# EAGLE schematic KickerBoard (EAGLE 9.3.0)
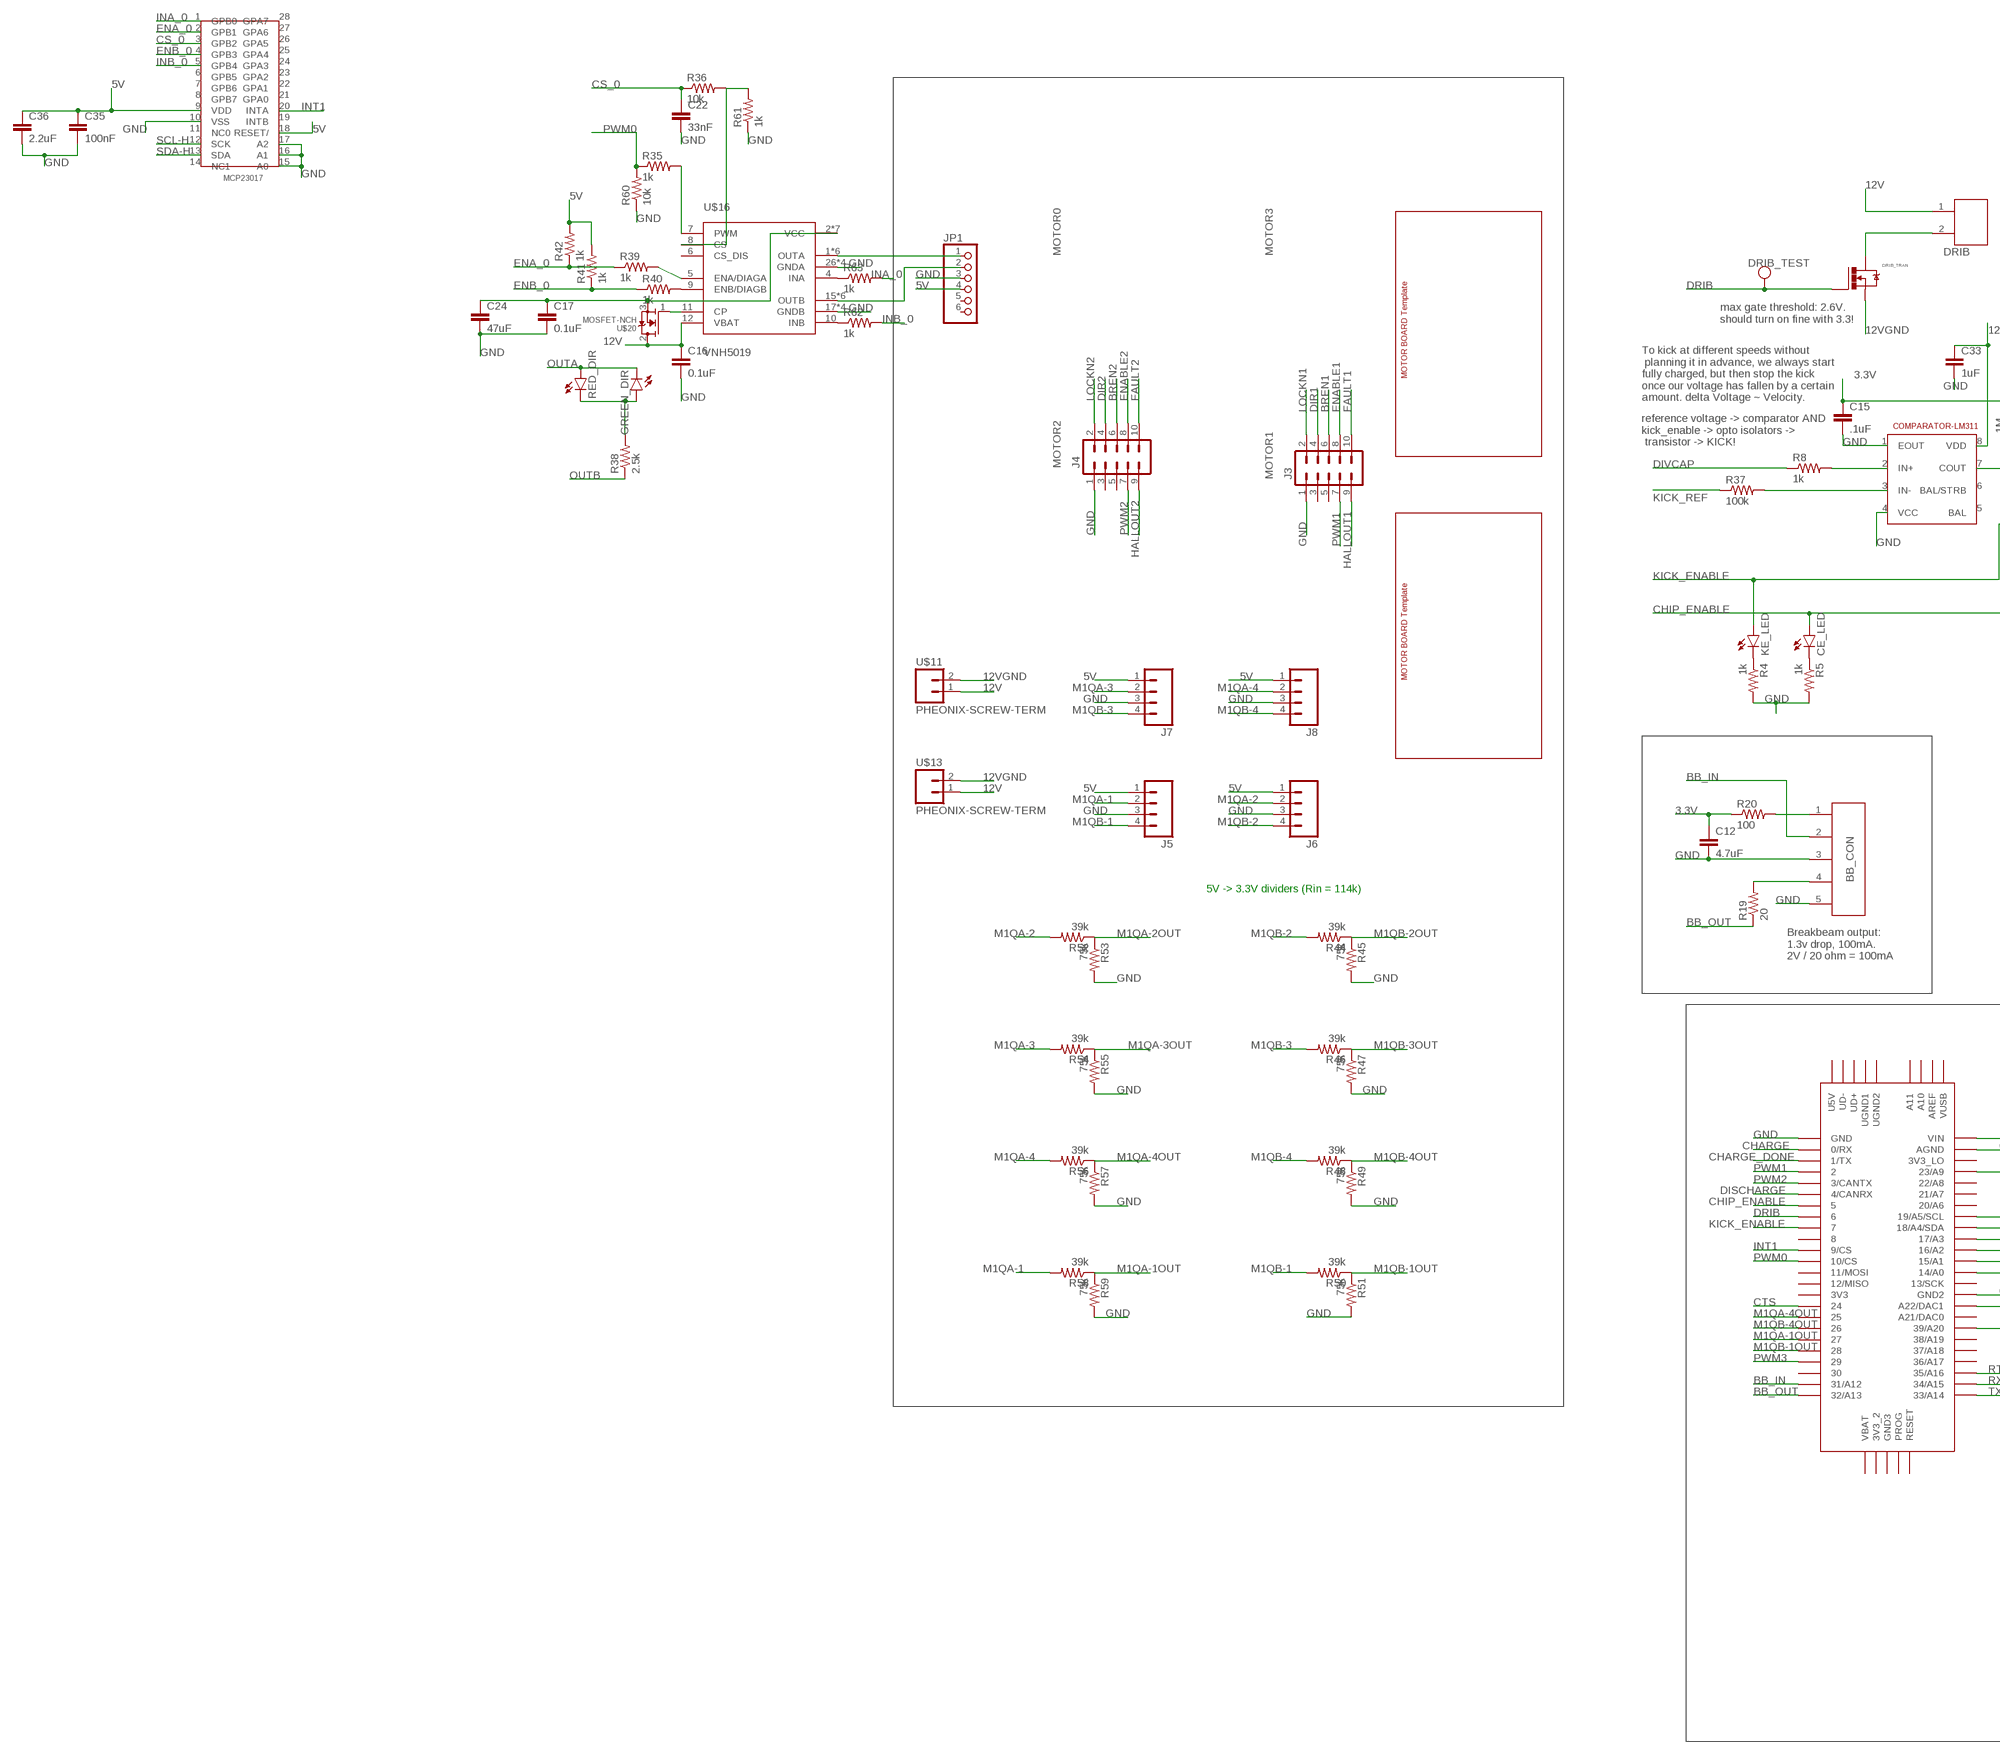
[diagram p0: schematic, sheet 1, part 1 of 2]
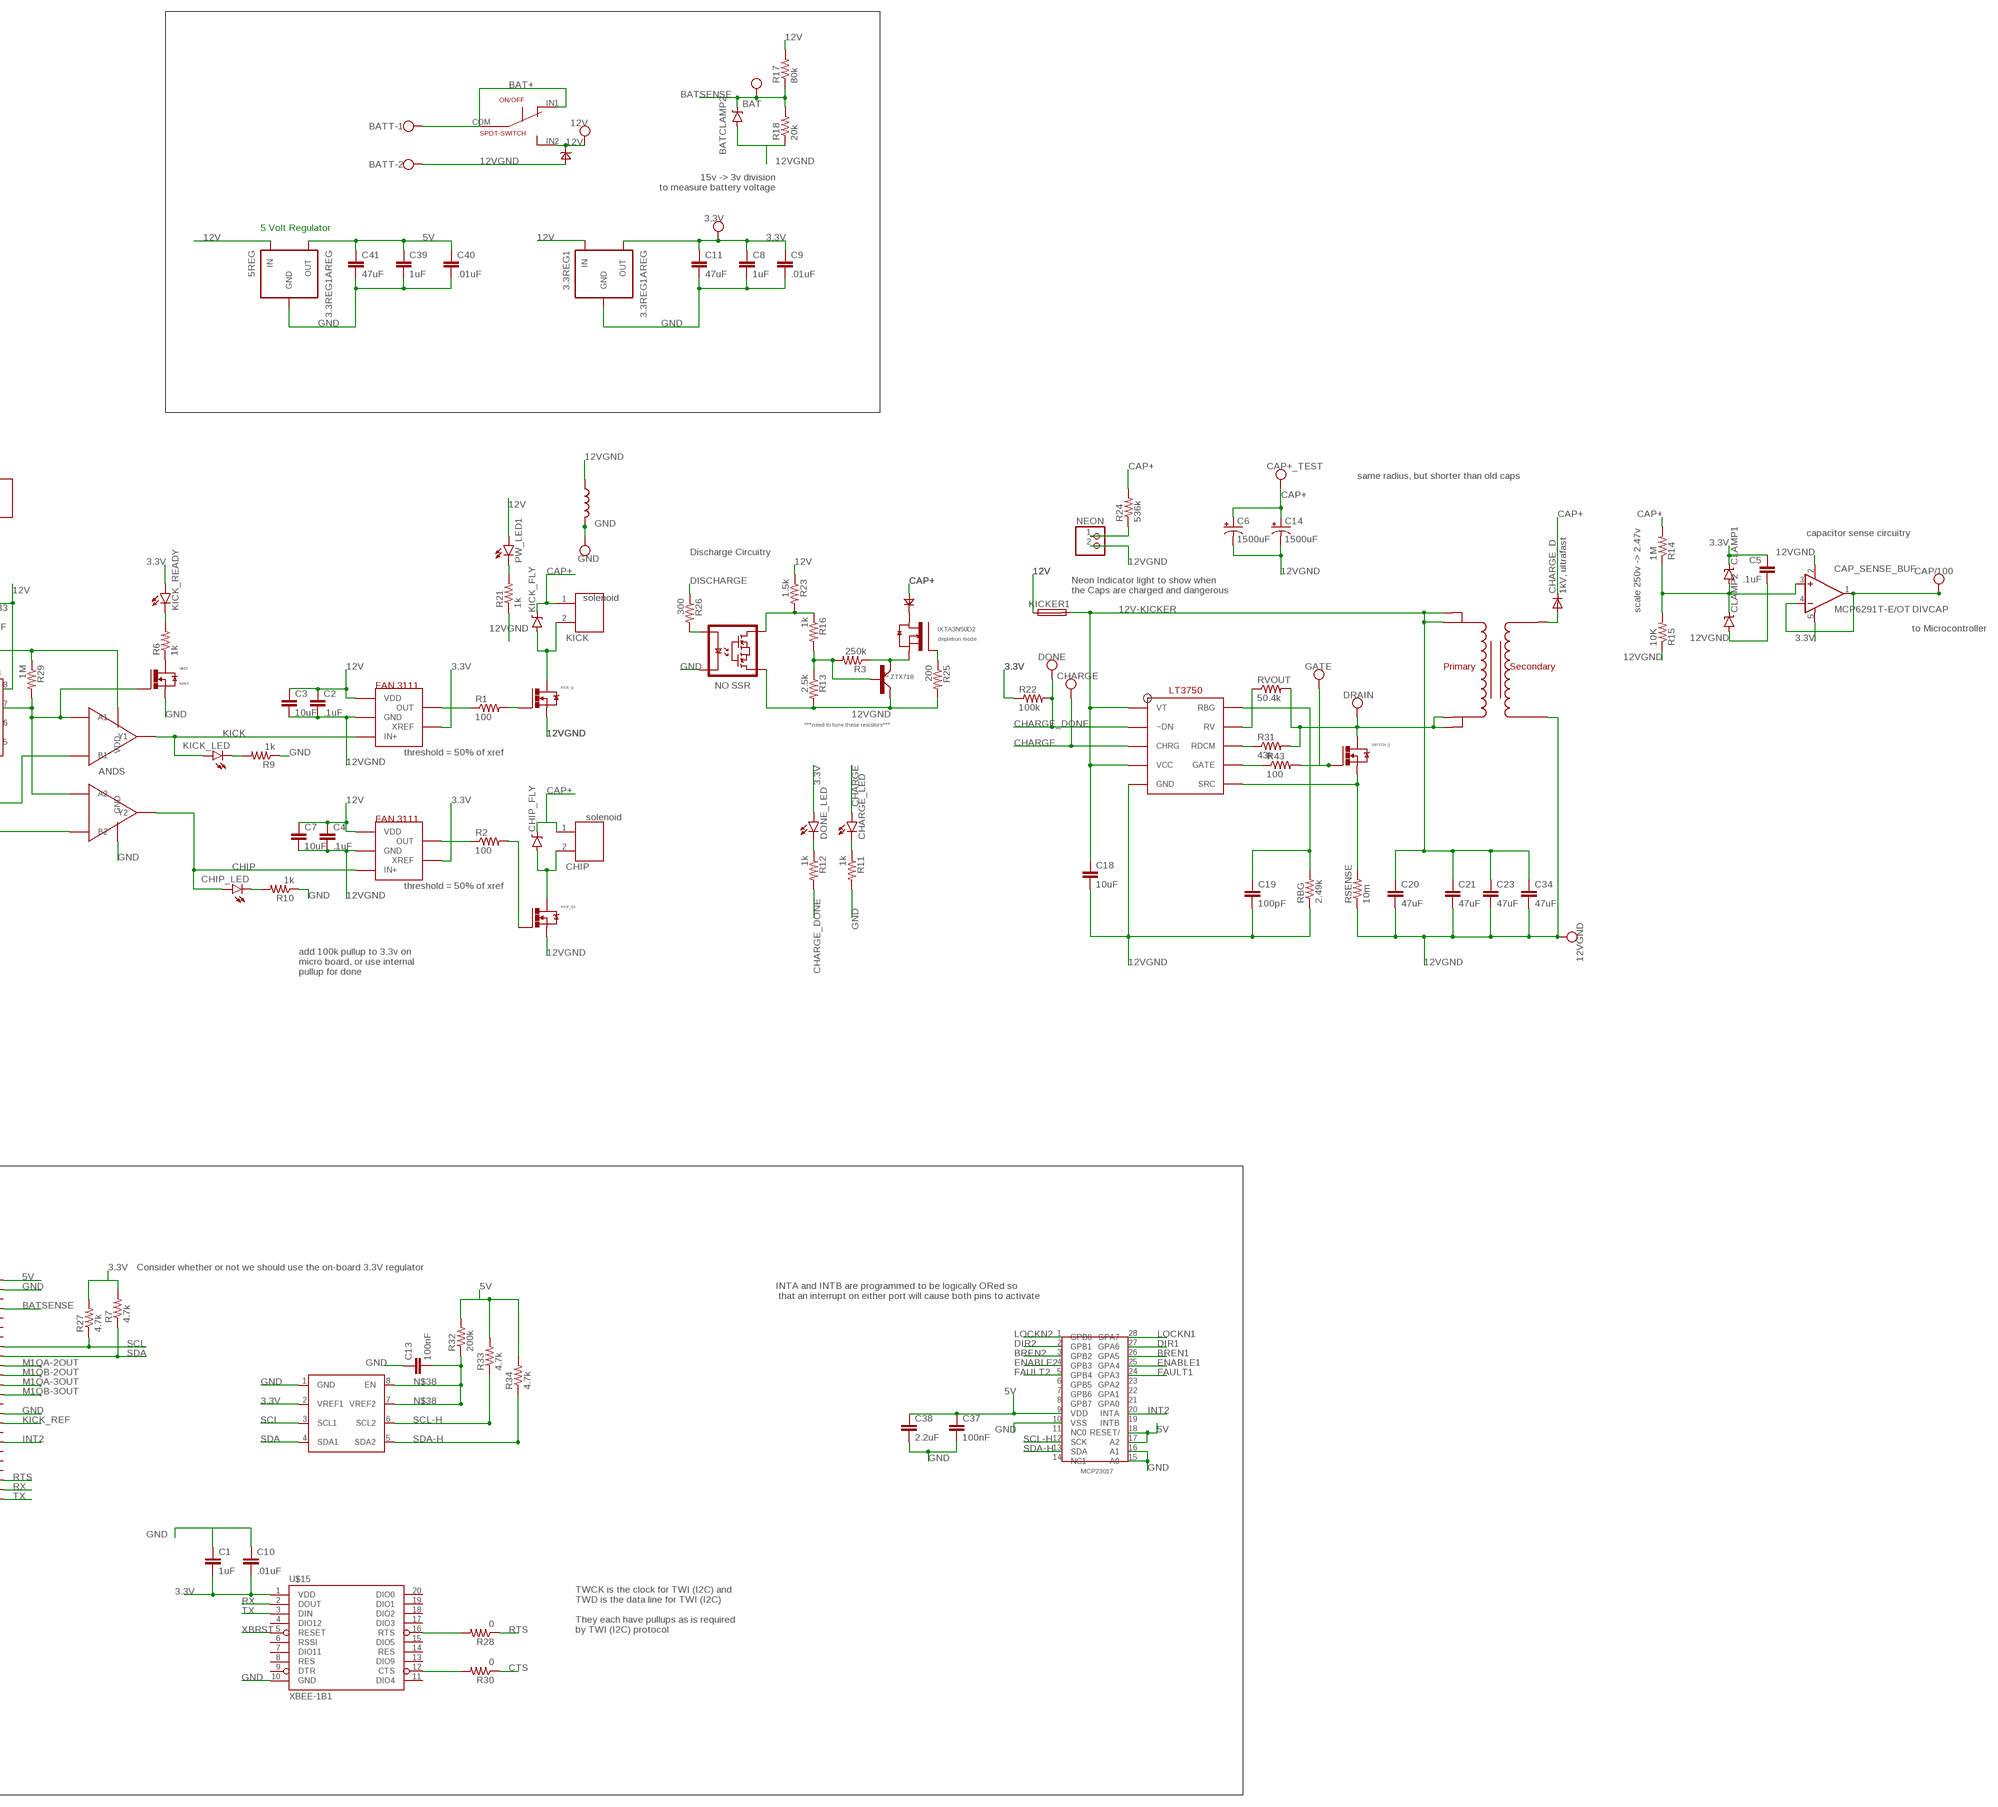
[diagram p1: schematic, sheet 1, part 2 of 2]

## Parts
3.3REG1  3.3REG1AREG  [DPAK]
3.3V  TEST_PT  [TESTING_PT]
5REG  3.3REG1AREG  [DPAK]
12V  TEST_PT  [TESTING_PT]
12VGND  TEST_PT  [TESTING_PT]
ANDS  AND-DUAL  [TSSOP8]
BAT  TEST_PT  [TESTING_PT]
BATCLAMP2  DIODE-ZENERDO214AC  [DO214AC]
BATT  W237-102  [W237-102]
BB_CON  JST-5  [JST-5-2MM]
C1  1uF  CAP1206  [1206]
C2  .1uF  CAP1206  [1206]
C3  10uF  CAP1206  [1206]
C4  .1uF  CAP1206  [1206]
C5  .1uF  CAP0805  [0805]
C6  1500uF  CPOL-USE10-35  [EB35D]
C7  10uF  CAP1206  [1206]
C8  1uF  CAP0805  [0805]
C9  .01uF  CAP0805  [0805]
C10  .01uF  CAP1206  [1206]
C11  47uF  CAP1206  [1206]
C12  4.7uF  CAP0805  [0805]
C13  100nF  CAP0805  [0805]
C14  1500uF  CPOL-USE10-35  [EB35D]
C15  .1uF  CAP0805  [0805]
C16  0.1uF  CAP0805  [0805]
C17  0.1uF  CAP0805  [0805]
C18  10uF  CAP0805  [0805]
C19  100pF  CAP0805  [0805]
C20  47uF  CAP1206  [1206]
C21  47uF  CAP1206  [1206]
C22  33nF  CAP0805  [0805]
C23  47uF  CAP1206  [1206]
C24  47uF  CAP1206  [1206]
C33  1uF  CAP1206  [1206]
C34  47uF  CAP1206  [1206]
C35  100nF  CAP0805  [0805]
C36  2.2uF  CAP0805  [0805]
C37  100nF  CAP0805  [0805]
C38  2.2uF  CAP0805  [0805]
C39  1uF  CAP0805  [0805]
C40  .01uF  CAP0805  [0805]
C41  47uF  CAP1206  [1206]
CAP+_TEST  TEST_PT  [TESTING_PT]
CAP/100  TEST_PT  [TESTING_PT]
CAP_SENSE_BUF  MCP6291T-E/OT  [SOT23-5]
CE_LED  LED1206  [LED-1206]
CHARGE  TEST_PT  [TESTING_PT]
CHARGE_D  1kV, ultrafast  DIODE-DO214AC  [DO214AC]
CHARGE_LED  LED1206  [LED-1206]
CHARGE_U  LT3750  [10-MSOP]
CHIP  JST-22MM  [JST-2-2MM]
CHIP_FLY  DIODE-ZENERDO214AB  [DO214AB]
CHIP_LED  LED1206  [LED-1206]
CLAMP1  DIODE-ZENERDO214AC  [DO214AC]
CLAMP2  DIODE-ZENERDO214AC  [DO214AC]
DONE  TEST_PT  [TESTING_PT]
DONE_LED  LED1206  [LED-1206]
DRAIN  TEST_PT  [TESTING_PT]
DRIB  JST-22MM  [JST-2-2MM]
DRIB_TEST  TEST_PT  [TESTING_PT]
DRIB_TRAN  N-MOSFETDPAK  [DPAK]
GATE  TEST_PT  [TESTING_PT]
GND  TEST_PT  [TESTING_PT]
GREEN_DIR  LED1206  [LED-1206]
J3  M05X2SHD  [2X5-SHROUDED]
J4  M05X2SHD  [2X5-SHROUDED]
J5  M04PTH  [1X04]
J6  M04PTH  [1X04]
J7  M04PTH  [1X04]
J8  M04PTH  [1X04]
JP1  PINHD-1X6  [1X06]
KE_LED  LED1206  [LED-1206]
KICK  JST-22MM  [JST-2-2MM]
KICK_FLY  DIODE-ZENERDO214AB  [DO214AB]
KICK_LED  LED1206  [LED-1206]
KICK_Q  N-MOSFETDPAK  [DPAK]
KICK_Q1  N-MOSFETDPAK  [DPAK]
KICK_READY  LED1206  [LED-1206]
KICKER1  TR5  [TR5]
NEON  PINHD-1X2  [1X02]
ON/OFF  SPDT-SWITCH  [CK_SWITCH]
PW_LED1  LED1206  [LED-1206]
R1  100  RESISTOR0805-RES  [0805]
R2  100  RESISTOR0805-RES  [0805]
R3  250k  RESISTOR0805-RES  [0805]
R4  1k  RESISTOR0805-RES  [0805]
R5  1k  RESISTOR0805-RES  [0805]
R6  1k  RESISTOR0805-RES  [0805]
R7  4.7k  RESISTOR0805-RES  [0805]
R8  1k  RESISTOR0805-RES  [0805]
R9  1k  RESISTOR0805-RES  [0805]
R10  1k  RESISTOR0805-RES  [0805]
R11  1k  RESISTOR0805-RES  [0805]
R12  1k  RESISTOR0805-RES  [0805]
R13  2.5k  RESISTOR0805-RES  [0805]
R14  1M  RESISTOR0805-RES  [0805]
R15  10K  RESISTOR0805-RES  [0805]
R16  1k  RESISTOR0805-RES  [0805]
R17  80k  RESISTOR0805-RES  [0805]
R18  20k  RESISTOR0805-RES  [0805]
R19  20  RESISTOR0805-RES  [0805]
R20  100  RESISTOR0805-RES  [0805]
R21  1k  RESISTOR0805-RES  [0805]
R22  100k  RESISTOR0805-RES  [0805]
R23  1.5k  RESISTOR0805-RES  [0805]
R24  536k  RESISTOR0805-RES  [0805]
R25  200  RESISTOR0805-RES  [0805]
R26  300  RESISTOR0805-RES  [0805]
R27  4.7k  RESISTOR0805-RES  [0805]
R28  0  RESISTOR0805-RES  [0805]
R29  1M  RESISTOR0805-RES  [0805]
R30  0  RESISTOR0805-RES  [0805]
R31  43k  RESISTOR0805-RES  [0805]
R32  200k  RESISTOR0805-RES  [0805]
R33  4.7k  RESISTOR0805-RES  [0805]
R34  4.7k  RESISTOR0805-RES  [0805]
R35  1k  RESISTOR0805-RES  [0805]
R36  10k  RESISTOR0805-RES  [0805]
R37  100k  RESISTOR0805-RES  [0805]
R38  2.5k  RESISTOR0805-RES  [0805]
R39  1k  RESISTOR0805-RES  [0805]
R40  1k  RESISTOR0805-RES  [0805]
R41  1k  RESISTOR0805-RES  [0805]
R42  1k  RESISTOR0805-RES  [0805]
R43  100  RESISTOR0805-RES  [0805]
R44  39k  RESISTOR0805-RES  [0805]
R45  75k  RESISTOR0805-RES  [0805]
R46  39k  RESISTOR0805-RES  [0805]
R47  75k  RESISTOR0805-RES  [0805]
R48  39k  RESISTOR0805-RES  [0805]
R49  75k  RESISTOR0805-RES  [0805]
R50  39k  RESISTOR0805-RES  [0805]
R51  75k  RESISTOR0805-RES  [0805]
R52  39k  RESISTOR0805-RES  [0805]
R53  75k  RESISTOR0805-RES  [0805]
R54  39k  RESISTOR0805-RES  [0805]
R55  75k  RESISTOR0805-RES  [0805]
R56  39k  RESISTOR0805-RES  [0805]
R57  75k  RESISTOR0805-RES  [0805]
R58  39k  RESISTOR0805-RES  [0805]
R59  75k  RESISTOR0805-RES  [0805]
R60  10k  RESISTOR0805-RES  [0805]
R61  1k  RESISTOR0805-RES  [0805]
R62  1k  RESISTOR0805-RES  [0805]
R63  1k  RESISTOR0805-RES  [0805]
RBG  2.49k  RESISTOR0805-RES  [0805]
RED_DIR  LED1206  [LED-1206]
RSENSE  10m  RESISTOR2512  [R2512]
RVOUT  50.4k  RESISTOR0805-RES  [0805]
SWITCH_Q  N-MOSFETDPAK  [DPAK]
U$1  FAN31111  [SOT23-5]
U$2  IXTA3N50D2  [TO-263]
U$3  32052-TRANSFORMER  [10-TRANSFORMER]
U$4  FAN31111  [SOT23-5]
U$5  VO1400AEFTR  [SOP4]
U$6  ZTX718  [TO92]
U$7  1N4007  [THROUGH-HOLE-2]
U$8  PCA9306  [SOIC8]
U$9  MOTOR_BOARD  [MOTOR_BOARD]
U$10  MOTOR_BOARD  [MOTOR_BOARD]
U$11  PHEONIX-SCREW-TERM  [1X02-PHEONIX]
U$12  13VZENER  [THROUGH-HOLE-2]
U$13  PHEONIX-SCREW-TERM  [1X02-PHEONIX]
U$14  TEENSY_3.5/3.6  [TEENSY_3.5/3.6]
U$15  XBEE-1B1  [XBEE-1]
U$16  VNH5019  [MULTIPOWERSO-30]
U$17  IO-EXPANDER  [SSOP]
U$18  LM311  [SOIC8]
U$19  INDUCTOR  [0805]
U$20  MOSFET-NCH  [TO252-3]
U$21  IO-EXPANDER  [SSOP]
U$22  N-FET  [SOT-23]

## Nets
3.3V: 3.3REG1.SOURCE(OUT) 3.3V.P$1 ANDS.P$8(VDD) C1.2 C5.1 C8.1 C9.1 C10.2 C11.1 C12.1 C15.1 CAP_SENSE_BUF.5(V+) CLAMP1.C DONE_LED.A KICK_READY.A R7.2 R20.1 R22.1 R27.2 R29.1 U$1.4(XREF) U$4.4(XREF) U$8.2(VREF1) U$15.1(VDD)
5V: 5REG.SOURCE(OUT) C35.1 C36.1 C37.1 C38.1 C39.1 C40.1 C41.1 J5.1 J6.1 J7.1 J8.1 JP1.4 R32.2 R33.2 R34.2 R41.2 R42.2 U$14.VIN U$17.9(VDD) U$17.18(RESET/) U$21.9(VDD) U$21.17(A2) U$21.18(RESET/)
12V: 3.3REG1.GATE(IN) 5REG.GATE(IN) 12V.P$1 C2.1 C3.1 C4.1 C7.1 C16.1 C33.1 DRIB.1 KICKER1.1 ON/OFF.IN2(P2) PW_LED1.A R17.2 R23.1 U$1.1(VDD) U$4.1(VDD) U$11.1 U$12.- U$13.1 U$16.12(VBAT) U$18.8(VDD) U$20.2(D)
12V-KICKER: C18.1 C20.1 C21.1 C23.1 C34.1 CHARGE_U.P$1(VT) CHARGE_U.P$4(VCC) KICKER1.2 U$3.P$4 U$3.P$5
12VGND: 12VGND.P$1 BATCLAMP2.A BATT.2 C2.2 C3.2 C4.2 C5.2 C6.- C7.2 C14.- C18.2 C19.2 C20.2 C21.2 C23.2 C34.2 CAP_SENSE_BUF.2(V-) CHARGE_U.P$5(GND) CLAMP2.A DRIB_TRAN.SOURCE(S) KICK_Q1.SOURCE(S) KICK_Q.SOURCE(S) NEON.2 R13.2 R15.1 R18.1 R21.1 R25.2 RBG.1 RSENSE.1 U$1.2(GND) U$3.P$10 U$4.2(GND) U$5.3(S2) U$6.LEFT(COLLECTOR) U$11.2 U$12.+ U$13.2 U$19.1
BAT+: BATT.1 ON/OFF.COM ON/OFF.IN1(P1)
BATSENSE: BAT.P$1 BATCLAMP2.C R17.1 R18.2 U$14.23/A9
BB_IN: BB_CON.2 U$14.31/A12
BB_OUT: R19.1 U$14.32/A13
BREN1: J3.6 U$21.26(GPA5)
BREN2: J4.6 U$21.3(GPB2)
CAP+: C6.+ C14.+ CAP+_TEST.P$1 CHARGE_D.C CHIP.1 CHIP_FLY.CATHODE(C) KICK.1 KICK_FLY.CATHODE(C) R14.2 R24.2 U$7.+(D+)
CHARGE: CHARGE.P$1 CHARGE_LED.A CHARGE_U.P$3(CHRG) U$14.0/RX
CHARGE_DONE: CHARGE_U.P$2(~DN) DONE.P$1 R12.2 R22.2 U$14.1/TX
CHIP: ANDS.P$3(Y2) CHIP_LED.A U$1.3(IN+)
CHIP_ENABLE: ANDS.P$6(B2) CE_LED.A U$14.5
COMP_OUT: ANDS.P$1(A1) ANDS.P$5(A2) R29.2 U$18.7(COUT) U$22.G
CS_0: C22.1 R36.1 U$17.3(GPB2)
CTS: R30.1 U$14.24
DIR1: J3.4 U$21.27(GPA6)
DIR2: J4.4 U$21.2(GPB1)
DISCHARGE: R26.1 U$14.4/CANRX
DIVCAP: CAP/100.P$1 CAP_SENSE_BUF.1(OUT) CAP_SENSE_BUF.4(-IN) R8.1
DRIB: DRIB_TEST.P$1 DRIB_TRAN.GATE(G) U$14.6
ENA_0: R39.1 R42.1 U$17.2(GPB1)
ENABLE1: J3.8 U$21.25(GPA4)
ENABLE2: J4.8 U$21.4(GPB3)
ENB_0: R40.1 R41.1 U$17.4(GPB3)
FAULT1: J3.10 U$21.24(GPA3)
FAULT2: J4.10 U$21.5(GPB4)
GND: 3.3REG1.DRAIN(GND) 5REG.DRAIN(GND) ANDS.P$4(GND) BB_CON.3 BB_CON.5 C8.2 C9.2 C10.1 C11.2 C12.2 C13.1 C15.2 C16.2 C17.2 C22.2 C24.2 C33.2 C35.2 C36.2 C37.2 C38.2 C39.2 C40.2 C41.2 GND.P$1 J3.1 J4.1 J5.3 J6.3 J7.3 J8.3 JP1.3 R4.2 R5.2 R9.1 R10.1 R11.2 R45.2 R47.2 R49.2 R51.2 R53.2 R55.2 R57.2 R59.2 R60.1 R61.1 U$5.2(LED-) U$8.1(GND) U$14.AGND U$14.GND U$14.GND2 U$15.10(GND) U$16.17(GNDB) U$16.18(GNDB) U$16.19(GNDB) U$16.20(GNDB) U$16.26(GNDA) U$16.27(GNDA) U$16.28(GNDA) U$16.29(GNDA) U$17.10(VSS) U$17.15(A0) U$17.16(A1) U$17.17(A2) U$18.1(EOUT) U$18.4(VCC) U$19.2 U$21.10(VSS) U$21.15(A0) U$21.16(A1) U$22.S
HALLOUT1: J3.9
HALLOUT2: J4.9
INA_0: R63.2 U$17.1(GPB0)
INB_0: R62.2 U$17.5(GPB4)
INT1: U$14.9/CS U$17.20(INTA)
INT2: U$14.39/A20 U$21.20(INTA)
KICK: ANDS.P$7(Y1) KICK_LED.A U$4.3(IN+)
KICK_ENABLE: ANDS.P$2(B1) KE_LED.A U$14.7
KICK_REF: R37.1 U$14.A22/DAC1
LOCKN1: J3.2 U$21.28(GPA7)
LOCKN2: J4.2 U$21.1(GPB0)
LOWCHIP: CHIP.2 CHIP_FLY.ANODE(A) KICK_Q1.DRAIN(D)
LOWKICK: KICK.2 KICK_FLY.ANODE(A) KICK_Q.DRAIN(D)
M1QA-1: J5.2 R58.2
M1QA-1OUT: R58.1 R59.1 U$14.27
M1QA-2: J6.2 R52.2
M1QA-2OUT: R52.1 R53.1 U$14.17/A3
M1QA-3: J7.2 R54.2
M1QA-3OUT: R54.1 R55.1 U$14.15/A1
M1QA-4: J8.2 R56.2
M1QA-4OUT: R56.1 R57.1 U$14.25
M1QB-1: J5.4 R50.2
M1QB-1OUT: R50.1 R51.1 U$14.28
M1QB-2: J6.4 R44.2
M1QB-2OUT: R44.1 R45.1 U$14.16/A2
M1QB-3: J7.4 R46.2
M1QB-3OUT: R46.1 R47.1 U$14.14/A0
M1QB-4: J8.4 R48.2
M1QB-4OUT: R48.1 R49.1 U$14.26
N$1: DRAIN.P$1 R31.2 RVOUT.2 SWITCH_Q.DRAIN(D) U$3.P$6 U$3.P$7
N$2: R1.1 U$4.5(OUT)
N$3: KICK_Q1.GATE(G) R2.2
N$4: R28.2 U$15.16(RTS)
N$5: R2.1 U$1.5(OUT)
N$6: CHARGE_U.P$8(RDCM) R31.1
N$7: C19.1 CHARGE_U.P$10(RBG) RBG.2
N$8: KICK_Q.GATE(G) R1.2
N$9: GATE.P$1 R43.2 SWITCH_Q.GATE(G)
N$10: R3.1 U$2.LOWER_RIGHT(SOURCE) U$6.RIGHT(EMITTER)
N$11: KE_LED.C R4.1
N$12: CHARGE_U.P$9(RV) RVOUT.1
N$13: CE_LED.C R5.1
N$14: R6.1 U$22.D
N$15: KICK_LED.C R9.2
N$16: R30.2 U$15.12(CTS)
N$17: CHIP_LED.C R10.2
N$18: R3.2 R13.1 R16.2 U$6.CENTER(BASE)
N$19: DONE_LED.C R12.1
N$20: CHARGE_LED.C R11.1
N$21: R25.1 U$2.LOWER_LEFT(GATE)
N$22: C1.1
N$23: PW_LED1.C R21.2
N$24: CHARGE_U.P$6(SRC) RSENSE.2 SWITCH_Q.SOURCE(S)
N$25: GREEN_DIR.A R38.2 RED_DIR.C
N$26: R36.2 R61.2 U$16.8(CS)
N$27: R35.2 U$16.7(PWM)
N$28: R39.2 U$16.5(ENA/DIAGA)
N$29: R16.1 R23.2 U$5.4(S1)
N$30: R26.2 U$5.1(LED+)
N$31: R40.2 U$16.9(ENB/DIAGB)
N$32: BB_CON.4 R19.2
N$33: KICK_READY.C R6.2
N$34: CHARGE_U.P$7(GATE) R43.1
N$35: R8.2 U$18.2(IN+)
N$36: U$2.TAB(DRAIN) U$7.-(D-)
N$37: R62.1 U$16.10(INB)
N$38: C13.2 R32.1 U$8.7(VREF2) U$8.8(EN)
N$39: R63.1 U$16.4(INA)
N$40: BB_CON.1 R20.2
N$41: U$16.11(CP) U$20.1(G)
N$42: C17.1 C24.1 U$16.2(VCC) U$16.3(VCC) U$16.13(VCC) U$16.14(VCC) U$16.23(VCC) U$16.VCC U$16.VCC@1(VCC) U$20.3(S)
N$65: R37.2 U$18.3(IN-)
OUTA: GREEN_DIR.C JP1.1 RED_DIR.A U$16.1(OUTA) U$16.24(OUTA) U$16.25(OUTA) U$16.30(OUTA) U$16.OUTA U$16.OUTA@1(OUTA)
OUTB: JP1.2 R38.1 U$16.15(OUTB) U$16.16(OUTB) U$16.21(OUTB) U$16.22(OUTB) U$16.OUTB U$16.OUTB@1(OUTB)
PWM0: R35.1 R60.2 U$14.10/CS
PWM1: J3.7 U$14.2
PWM2: J4.7 U$14.3/CANTX
PWM3: U$14.29
RTS: R28.1 U$14.35/A16
RX: U$14.34/A15 U$15.2(DOUT)
SCL: R27.1 U$8.3(SCL1) U$14.19/A5/SCL
SCL-H: R33.1 U$8.6(SCL2) U$17.12(SCK) U$21.12(SCK)
SDA: R7.1 U$8.4(SDA1) U$14.18/A4/SDA
SDA-H: R34.1 U$8.5(SDA2) U$17.13(SDA) U$21.13(SDA)
TO_DRIB: DRIB.2 DRIB_TRAN.DRAIN(D)
TO_NEON: NEON.1 R24.1
TRANS_OUT: CHARGE_D.A U$3.P$1
TX: U$14.33/A14 U$15.3(DIN)
UNBUF_DIVCAP: CAP_SENSE_BUF.3(+IN) CLAMP1.A CLAMP2.C R14.1 R15.2
XBRST: U$15.5(RESET)
Unconnected: J3.3 J3.5 J4.3 J4.5 JP1.5 JP1.6 U$14.3V3 U$14.3V3_2 U$14.3V3_LO U$14.8 U$14.11/MOSI U$14.12/MISO U$14.13/SCK U$14.20/A6 U$14.21/A7 U$14.21/DAC0(A21/DAC0) U$14.22/A8 U$14.30 U$14.36/A17 U$14.37/A18 U$14.38/A19 U$14.A10 U$14.A11 U$14.AREF U$14.GND3 U$14.PROG U$14.RESET U$14.U5V U$14.UD+ U$14.UD- U$14.UGND1 U$14.UGND2 U$14.VBAT U$14.VUSB U$15.4(DIO12) U$15.6(RSSI) U$15.7(DIO11) U$15.8(RES) U$15.9(DTR) U$15.11(DIO4) U$15.13(DIO9) U$15.14(RES) U$15.15(DIO5) U$15.17(DIO3) U$15.18(DIO2) U$15.19(DIO1) U$15.20(DIO0) U$16.6(CS_DIS) U$17.6(GPB5) U$17.7(GPB6) U$17.8(GPB7) U$17.11(NC0) U$17.14(NC1) U$17.19(INTB) U$17.21(GPA0) U$17.22(GPA1) U$17.23(GPA2) U$17.24(GPA3) U$17.25(GPA4) U$17.26(GPA5) U$17.27(GPA6) U$17.28(GPA7) U$18.5(BAL) U$18.6(BAL/STRB) U$21.6(GPB5) U$21.7(GPB6) U$21.8(GPB7) U$21.11(NC0) U$21.14(NC1) U$21.19(INTB) U$21.21(GPA0) U$21.22(GPA1) U$21.23(GPA2)

## Notes on the sheet
- 15v -> 3v division
  to measure battery voltage
- 5 Volt Regulator
- same radius, but shorter than old caps
- MOTOR0 | MOTOR3
- capacitor sense circuitry
- Discharge Circuitry
- max gate threshold: 2.6V. 
  should turn on fine with 3.3!
- Neon Indicator light to show when
  the Caps are charged and dangerous
- solenoid
- scale 250v -> 2.47v
- IXTA3N50D2 | to Microcontroller
- depletion mode
- To kick at different speeds without
   planning it in advance, we always start 
  fully charged, but then stop the kick 
  once our voltage has fallen by a certain 
  amount. delta Voltage ~ Velocity.
- ZTX718
- reference voltage -> comparator AND 
  kick_enable -> opto isolators ->
   transistor -> KICK!
- NO SSR
- MOTOR2
- MOTOR1
- ***need to tune these resistors***
- threshold = 50% of xref
- solenoid
- threshold = 50% of xref
- add 100k pullup to 3.3v on 
  micro board, or use internal 
  pullup for done
- 5V -> 3.3V dividers (Rin = 114k)
- Breakbeam output:
  1.3v drop, 100mA.
  2V / 20 ohm = 100mA
- Consider whether or not we should use the on-board 3.3V regulator
- INTA and INTB are programmed to be logically ORed so
   that an interrupt on either port will cause both pins to activate
- TWCK is the clock for TWI (I2C) and 
  TWD is the data line for TWI (I2C)
  
  They each have pullups as is required 
  by TWI (I2C) protocol

## Library data of the parts
3.3REG1 5REG = gen3:3.3REG1A
3.3V 12V 12VGND BAT CAP+_TEST CAP/100 CHARGE DONE DRAIN DRIB_TEST GATE GND = gen3:TEST_PT: Testing Point Use to probe a signal
ANDS = gen3:AND-DUAL
BATCLAMP2 CHIP_FLY CLAMP1 CLAMP2 KICK_FLY = gen3:DIODE-ZENER: Zener Diode Production Part - 8199 3.4V Zener Voltage
BATT = con-wago-500:W237-102: WAGO SCREW CLAMP; MPN: 237-102; OC_FARNELL: unknown; OC_NEWARK: 70K9898
BB_CON = gen3:JST-5
C1-C5 C7-C13 C15-C24 C33-C41 = SparkFun-Capacitors:CAP: Capacitor Standard 0603 ceramic capacitor, and 0.1" leaded capacitor.
C6 C14 = rcl:CPOL-US: POLARIZED CAPACITOR, American symbol; SPICEPREFIX: C
CAP_SENSE_BUF = SparkFun-AnalogIC:MCP6291: Rail to rail OpAmp with 10MHz GBP; PROD_ID: IC-11991
CE_LED CHARGE_LED CHIP_LED DONE_LED GREEN_DIR KE_LED KICK_LED KICK_READY PW_LED1 RED_DIR = SparkFun-LED:LED: LEDs Standard schematic elements and footprints for 5mm, 3mm, 1206, and 0603 sized LEDs. 5mm - Spark Fun Electronics SKU : COM-00529 (and others)
CHARGE_D = gen3:DIODE-: DIODE
CHARGE_U = kickerchips:LT3750
CHIP DRIB KICK = gen3:JST-2
DRIB_TRAN KICK_Q KICK_Q1 SWITCH_Q = gen3:N-MOSFET: N-Channel Power Mosfet
J3 J4 = SparkFun-Connectors:M05X2: Header 5x2 Standard 10-pin dual row 0.1" header. Commonly used with AVR-ISP. Use with Spark Fun Electronics SKU: PRT-00778
J5-J8 = SparkFun-Connectors:M04: Header 4 Standard 4-pin 0.1" header. Use with straight break away headers (SKU : PRT-00116), right angle break away headers (PRT-00553), swiss pins (PRT-00743), machine pins (PRT-00117), and female headers (PRT-00115). Molex polarized connector foot print use with SKU : PRT-08231 with associated crimp pins and housings. 1MM SMD Version SKU: PRT-10208; PROD_ID: CONN-09696
JP1 = pinhead:PINHD-1X6: PIN HEADER
KICKER1 = fuse:TR5: FUSE Wickmann; OC_FARNELL: unknown; OC_NEWARK: unknown
NEON = pinhead:PINHD-1X2: PIN HEADER
ON/OFF = gen3:SPDT-SWITCH
R1 R2 R7 R14 R15 R27 R28 R30 R32-R34 = SparkFun-Resistors:RESISTOR: Resistor Basic schematic elements and footprints for 0603, 1206, and PTH resistors.
R3-R6 R8-R13 R16-R26 R29 R31 R35-R63 RBG RSENSE RVOUT = SparkFun-Passives:RESISTOR: Resistor Basic schematic elements and footprints for 0603, 1206, and PTH resistors.
U$1 U$4 = kickerchips:FAN3111: FAN3111 Low Side Gate Driver, 1A. switches at 50% of xref
U$2 = rfc:IXTA3N50D2
U$3 = gen3:32052-TRANSFORMER: 32052 flyback transformer digikey #: 732-2129-1-ND
U$5 = rfc:VO1400AEFTR
U$6 = rfc:ZTX718
U$7 = rfc:1N4007
U$8 = SparkFun-AnalogIC:PCA9306
U$9 U$10 = Kicker:MOTOR_BOARD
U$11 U$13 = SparkFun-Connectors:PHEONIX-SCREW-TERM
U$12 = rfc:13VZENER
U$14 = Teensy356:TEENSY_3.5/3.6
U$15 = gen3:XBEE-1: Xbee module footprints SMT header is CONN-09042.
U$16 = IAD-Library:VNH5019: The VHN5019A-E is a full bridge motor driver intended for a wide range of automotive applications. The device incorporates a dual monolithic high-side drivers and two low-side switches. The high-side driver switch is designed using STMicroelectronics’ well known and proven proprietary VIPower® M0 technology that allows to efficiently integrate on the same die a true Power MOSFET with an intelligent signal/protection circuit.
U$17 U$21 = Kicker:IO-EXPANDER
U$18 = foe-scale:LM311
U$19 = gen3:INDUCTOR
U$20 = IAD-Library:MOSFET-NCH: N-Channel MOSFET like the IPB80N03S4L-03.
U$22 = rfc:N-FET: Small N-fet MOSFET N-CH 60V 300MA SOT-23 2N7002K-T1-E3